# Altium schematic sheet SAM9X75 Pinout.SchDoc
size A4; SheetNumber: 2; SheetTotal: 10
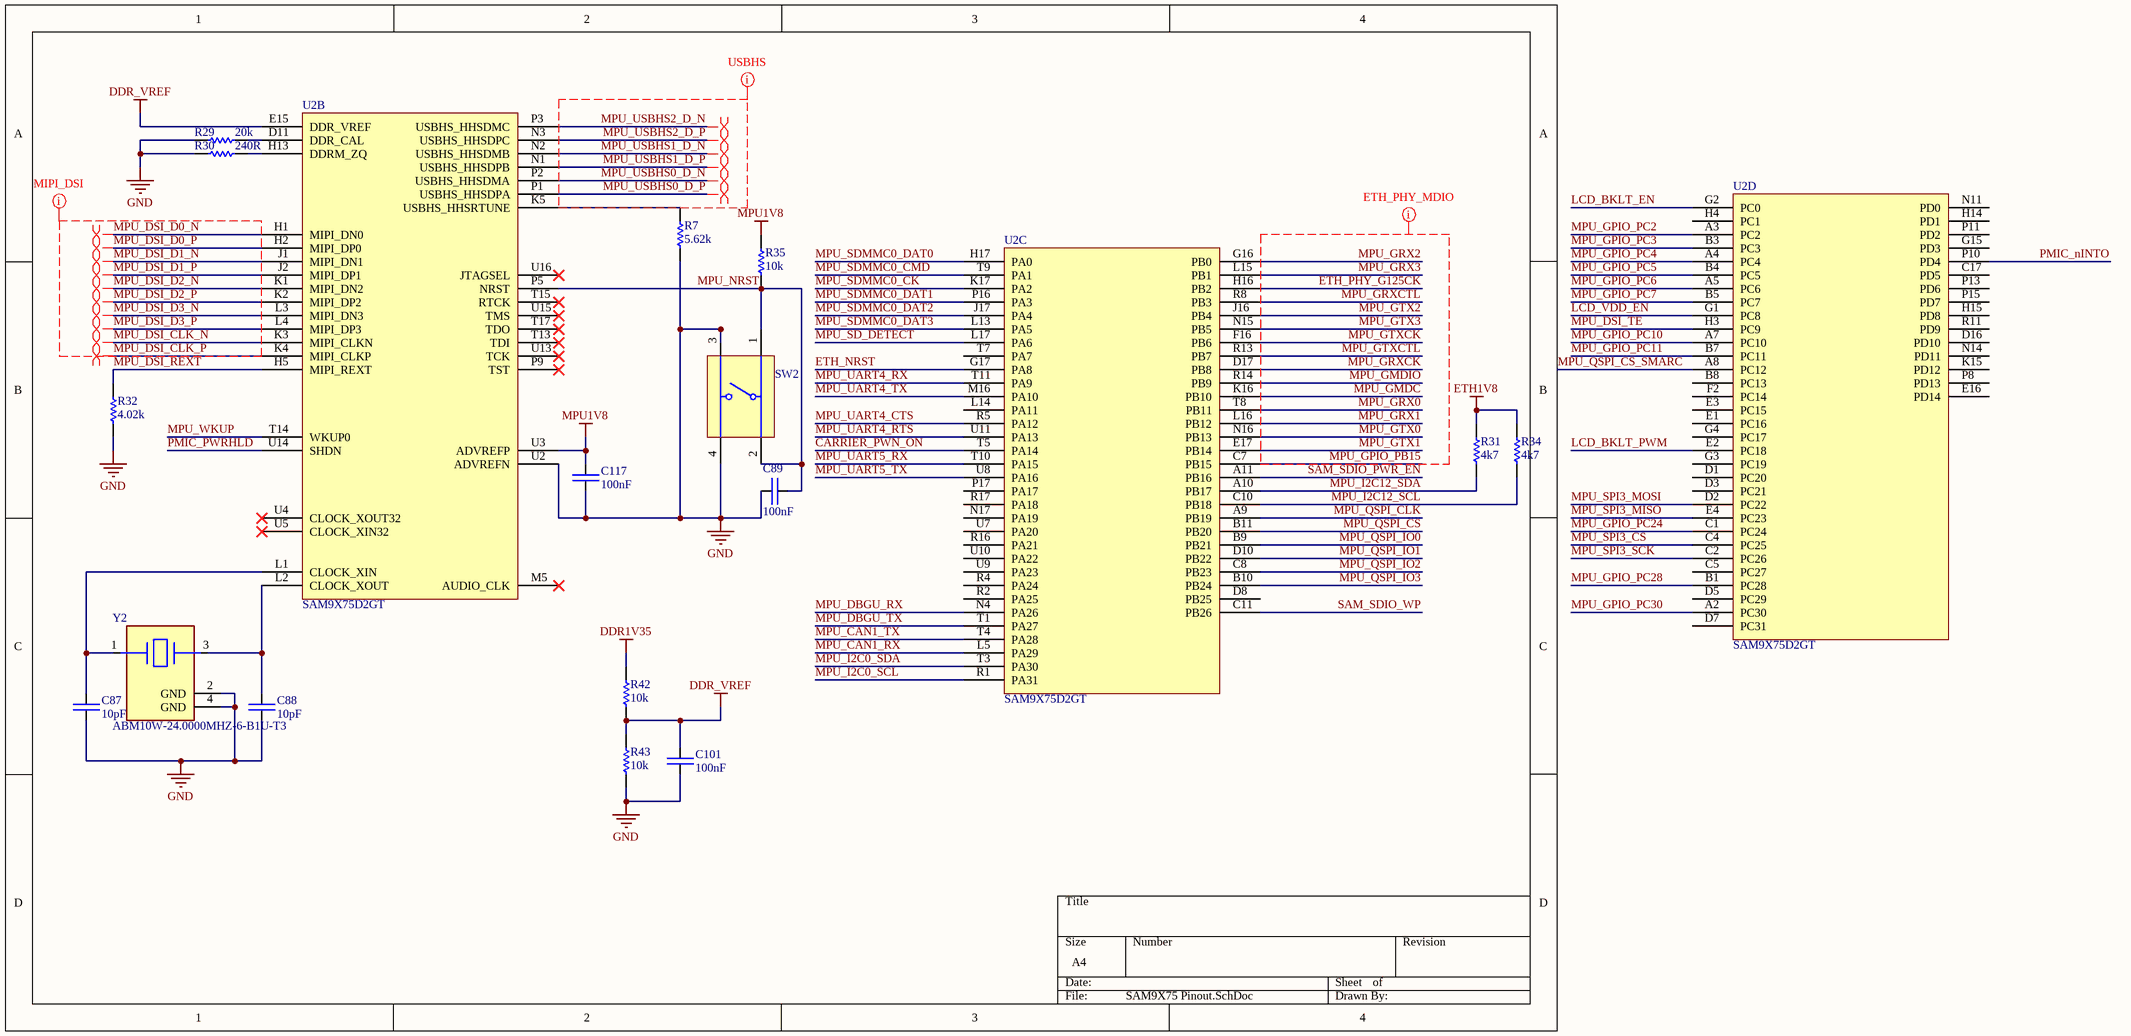
[diagram p0: SAM9X75 Pinout.SchDoc]

## Parts
C87  10pF  [CAP-0603]
C88  10pF  [CAP-0603]
C89  100nF  [CAP-0603]
C101  100nF  [CAP-0201]
C117  100nF  [CAP-0201]
R7  5.62k  [RES-0201]
R29  20k  [RES-0201]
R30  240R  [RES-0201]
R31  4k7  [RES-0201]
R32  4.02k  [RES-0201]
R34  4k7  [RES-0201]
R35  10k  [RES-0603]
R42  10k  [RES-0201]
R43  10k  [RES-0201]
SW2  FSM4JSMATR  [TECO-FSM4JSMATR_V]  (value not drawn)
U2  SAM9X75D2GT  [SAM9X75D]  (parts B,C,D of 4)
Y2  ABM10W-24.0000MHZ-6-B1U-T3  [FP-ABM10W-MFG]

## Nets
DDR1V35: R42.2
DDR_VREF: C101.2 R42.1 R43.2 U2.E15(DDR_VREF)
ETH1V8: R31.2 R34.2
GND: C87.1 C88.1 C89.2 C101.1 C117.1 R7.1 R29.1 R30.1 R32.1 R43.1 SW2.3 SW2.4 U2.U2(ADVREFN) Y2.2(GND) Y2.4(GND)
MPU1V8: C117.2 R35.2 U2.U3(ADVREFP)
CARRIER_PWN_ON: U2.T5(PA14)
ETH_NRST: U2.G17(PA8)
ETH_PHY_G125CK: U2.H16(PB2)
LCD_BKLT_EN: U2.G2(PC0)
LCD_BKLT_PWM: U2.E2(PC18)
LCD_VDD_EN: U2.G1(PC8)
MPU_CAN1_RX: U2.L5(PA29)
MPU_CAN1_TX: U2.T4(PA28)
MPU_DBGU_RX: U2.N4(PA26)
MPU_DBGU_TX: U2.T1(PA27)
MPU_DSI_CLK_N: U2.K3(MIPI_CLKN)
MPU_DSI_CLK_P: U2.K4(MIPI_CLKP)
MPU_DSI_D0_N: U2.H1(MIPI_DN0)
MPU_DSI_D0_P: U2.H2(MIPI_DP0)
MPU_DSI_D1_N: U2.J1(MIPI_DN1)
MPU_DSI_D1_P: U2.J2(MIPI_DP1)
MPU_DSI_D2_N: U2.K1(MIPI_DN2)
MPU_DSI_D2_P: U2.K2(MIPI_DP2)
MPU_DSI_D3_N: U2.L3(MIPI_DN3)
MPU_DSI_D3_P: U2.L4(MIPI_DP3)
MPU_DSI_REXT: R32.2 U2.H5(MIPI_REXT)
MPU_DSI_TE: U2.H3(PC9)
MPU_GMDC: U2.K16(PB10)
MPU_GMDIO: U2.R14(PB9)
MPU_GPIO_PB15: U2.C7(PB15)
MPU_GPIO_PC2: U2.A3(PC2)
MPU_GPIO_PC3: U2.B3(PC3)
MPU_GPIO_PC4: U2.A4(PC4)
MPU_GPIO_PC5: U2.B4(PC5)
MPU_GPIO_PC6: U2.A5(PC6)
MPU_GPIO_PC7: U2.B5(PC7)
MPU_GPIO_PC10: U2.A7(PC10)
MPU_GPIO_PC11: U2.B7(PC11)
MPU_GPIO_PC24: U2.C1(PC24)
MPU_GPIO_PC28: U2.B1(PC28)
MPU_GPIO_PC30: U2.A2(PC30)
MPU_GRX0: U2.T8(PB11)
MPU_GRX1: U2.L16(PB12)
MPU_GRX2: U2.G16(PB0)
MPU_GRX3: U2.L15(PB1)
MPU_GRXCK: U2.D17(PB8)
MPU_GRXCTL: U2.R8(PB3)
MPU_GTX0: U2.N16(PB13)
MPU_GTX1: U2.E17(PB14)
MPU_GTX2: U2.J16(PB4)
MPU_GTX3: U2.N15(PB5)
MPU_GTXCK: U2.F16(PB6)
MPU_GTXCTL: U2.R13(PB7)
MPU_I2C0_SCL: U2.R1(PA31)
MPU_I2C0_SDA: U2.T3(PA30)
MPU_I2C12_SCL: R34.1 U2.C10(PB18)
MPU_I2C12_SDA: R31.1 U2.A10(PB17)
MPU_NRST: C89.1 R35.1 SW2.1 SW2.2 U2.P5(NRST)
MPU_QSPI_CLK: U2.A9(PB19)
MPU_QSPI_CS: U2.B11(PB20)
MPU_QSPI_CS_SMARC: U2.A8(PC12)
MPU_QSPI_IO0: U2.B9(PB21)
MPU_QSPI_IO1: U2.D10(PB22)
MPU_QSPI_IO2: U2.C8(PB23)
MPU_QSPI_IO3: U2.B10(PB24)
MPU_SD_DETECT: U2.L17(PA6)
MPU_SDMMC0_CK: U2.K17(PA2)
MPU_SDMMC0_CMD: U2.T9(PA1)
MPU_SDMMC0_DAT0: U2.H17(PA0)
MPU_SDMMC0_DAT1: U2.P16(PA3)
MPU_SDMMC0_DAT2: U2.J17(PA4)
MPU_SDMMC0_DAT3: U2.L13(PA5)
MPU_SPI3_CS: U2.C4(PC25)
MPU_SPI3_MISO: U2.E4(PC23)
MPU_SPI3_MOSI: U2.D2(PC22)
MPU_SPI3_SCK: U2.C2(PC26)
MPU_UART4_CTS: U2.R5(PA12)
MPU_UART4_RTS: U2.U11(PA13)
MPU_UART4_RX: U2.T11(PA9)
MPU_UART4_TX: U2.M16(PA10)
MPU_UART5_RX: U2.T10(PA15)
MPU_UART5_TX: U2.U8(PA16)
MPU_USBHS0_D_N: U2.P2(USBHS_HHSDMA)
MPU_USBHS0_D_P: U2.P1(USBHS_HHSDPA)
MPU_USBHS1_D_N: U2.N2(USBHS_HHSDMB)
MPU_USBHS1_D_P: U2.N1(USBHS_HHSDPB)
MPU_USBHS2_D_N: U2.P3(USBHS_HHSDMC)
MPU_USBHS2_D_P: U2.N3(USBHS_HHSDPC)
MPU_WKUP: U2.T14(WKUP0)
PMIC_nINTO: U2.P10(PD4)
PMIC_PWRHLD: U2.U14(SHDN)
SAM_SDIO_PWR_EN: U2.A11(PB16)
SAM_SDIO_WP: U2.C11(PB26)
NetC87_2: C87.2 U2.L1(CLOCK_XIN) Y2.1
NetC88_2: C88.2 U2.L2(CLOCK_XOUT) Y2.3
NetR7_2: R7.2 U2.K5(USBHS_HHSRTUNE)
NetR29_2: R29.2 U2.D11(DDR_CAL)
NetR30_2: R30.2 U2.H13(DDRM_ZQ)

Not connected (* = marked no-connect by the designer): U2 B8(PC13) C5(PC27) C17(PD5) D1(PC20) D3(PC21) D5(PC29) D7(PC31) D8(PB25) D16(PD10) E1(PC16) E3(PC15) E16(PD14) F2(PC14) G3(PC19) G4(PC17) G15(PD3) H4(PC1) H14(PD1) H15(PD8) K15(PD12) L14(PA11) M5(AUDIO_CLK)* N11(PD0) N14(PD11) N17(PA19) P8(PD13) P9(TST)* P11(PD2) P13(PD6) P15(PD7) P17(PA17) R2(PA25) R4(PA24) R11(PD9) R16(PA21) R17(PA18) T7(PA7) T13(TDI)* T15(RTCK)* T17(TDO)* U4(CLOCK_XOUT32)* U5(CLOCK_XIN32)* U7(PA20) U9(PA23) U10(PA22) U13(TCK)* U15(TMS)* U16(JTAGSEL)*

## Layout directives
differential pair: MPU_DSI_CLK_N, MPU_DSI_CLK_P, MPU_DSI_D0_N, MPU_DSI_D0_P, MPU_DSI_D1_N, MPU_DSI_D1_P, MPU_DSI_D2_N, MPU_DSI_D2_P, MPU_DSI_D3_N, MPU_DSI_D3_P, MPU_USBHS0_D_N, MPU_USBHS0_D_P, MPU_USBHS1_D_N, MPU_USBHS1_D_P, MPU_USBHS2_D_N, MPU_USBHS2_D_P
net class MIPI_DSI_PAIRS: MPU_DSI_CLK_N, MPU_DSI_CLK_P, MPU_DSI_D0_N, MPU_DSI_D0_P, MPU_DSI_D1_N, MPU_DSI_D1_P, MPU_DSI_D2_N, MPU_DSI_D2_P, MPU_DSI_D3_N, MPU_DSI_D3_P
net class ETH_PHY_MDIO: ETH_PHY_G125CK, MPU_GMDC, MPU_GMDIO, MPU_GPIO_PB15, MPU_GRX0, MPU_GRX1, MPU_GRX2, MPU_GRX3, MPU_GRXCK, MPU_GRXCTL, MPU_GTX0, MPU_GTX1, MPU_GTX2, MPU_GTX3, MPU_GTXCK, MPU_GTXCTL
net class USBHS: MPU_USBHS0_D_N, MPU_USBHS0_D_P, MPU_USBHS1_D_N, MPU_USBHS1_D_P, MPU_USBHS2_D_N, MPU_USBHS2_D_P

## Library data of the parts
C87-C89 = CAP-0603: Capacitor chip unpolarized. 0603
C101 C117 = CAP-0201: Capacitor chip upolarized. 0201
R7 R29-R32 R34 R42 R43 = RES-0201: Resistor chip. 0201
R35 = RES-0603: Resistor chip. 0603
SW2 = CMP-2000-07486-1: Micro Miniature Push Button Switch FSM JSM, 50 mA, -35 to 85 degC, 4-Pin SMD, RoHS, Tape and Reel; Manufacturer: TE Connectivity; Mechanical Life: 100000Cycles; Current Rating: 50mA; Actuator Material: Polyamide; Max Voltage Rating (DC): 12V; Capacitance: 0f; Illumination Type: Illuminated; Voltage Rating (DC): 24V; Case\/Package: SMD/SMT; Operating Force: 160gf; Contact Resistance: 100mOhm; Actuator Length: 0.055inch; Switch Travel: 0.25mm; Throw Configuration: SPST; Termination: GullWing; Contact Plating: Silver; Orientation: Straight; Mounting Technology: SurfaceMount; REACH SVHC: Unknown; Electrical Life: 100000Cycles; Package Reference: FSM4JSMATR; Max Operating Temperature: 85degC; Manufacturer URL: http://www.te.com/; Package Description: 4-Pin Surface Mount Device, Body 6 x 6 mm, Pitch 4.5 mm; Datasheet Version: Rev. V, 02/2015; Packaging: TapeandReel; Min Operating Temperature: -35degC; Mount: SurfaceMount; Contact Current Rating: 50mA; Contact Material: CopperAlloy; Package Quantity: 1200; Datasheet URL: http://www.te.com/commerce/DocumentDelivery/DDEController?Action=showdoc&DocId=Customer+Drawing%7F2-1437565-7%7FV%7Fpdf%7FEnglish%7FENG_CD_2-1437565-7_V.pdf%7F4-1437565-2; RoHSCompliant: true
U2 = SAM9X75D2GT: ARM9 SiP 2GBit Internal DDR3L
Y2 = CMP-27762-005164-1: Crystal 24MHz ±10ppm 6pF SMD-4 2.5mm x 2mm